# Altium schematic sheet 8 Clock buffer.SchDoc
size 420 x 297 mm; SheetNumber: 9; SheetTotal: 9
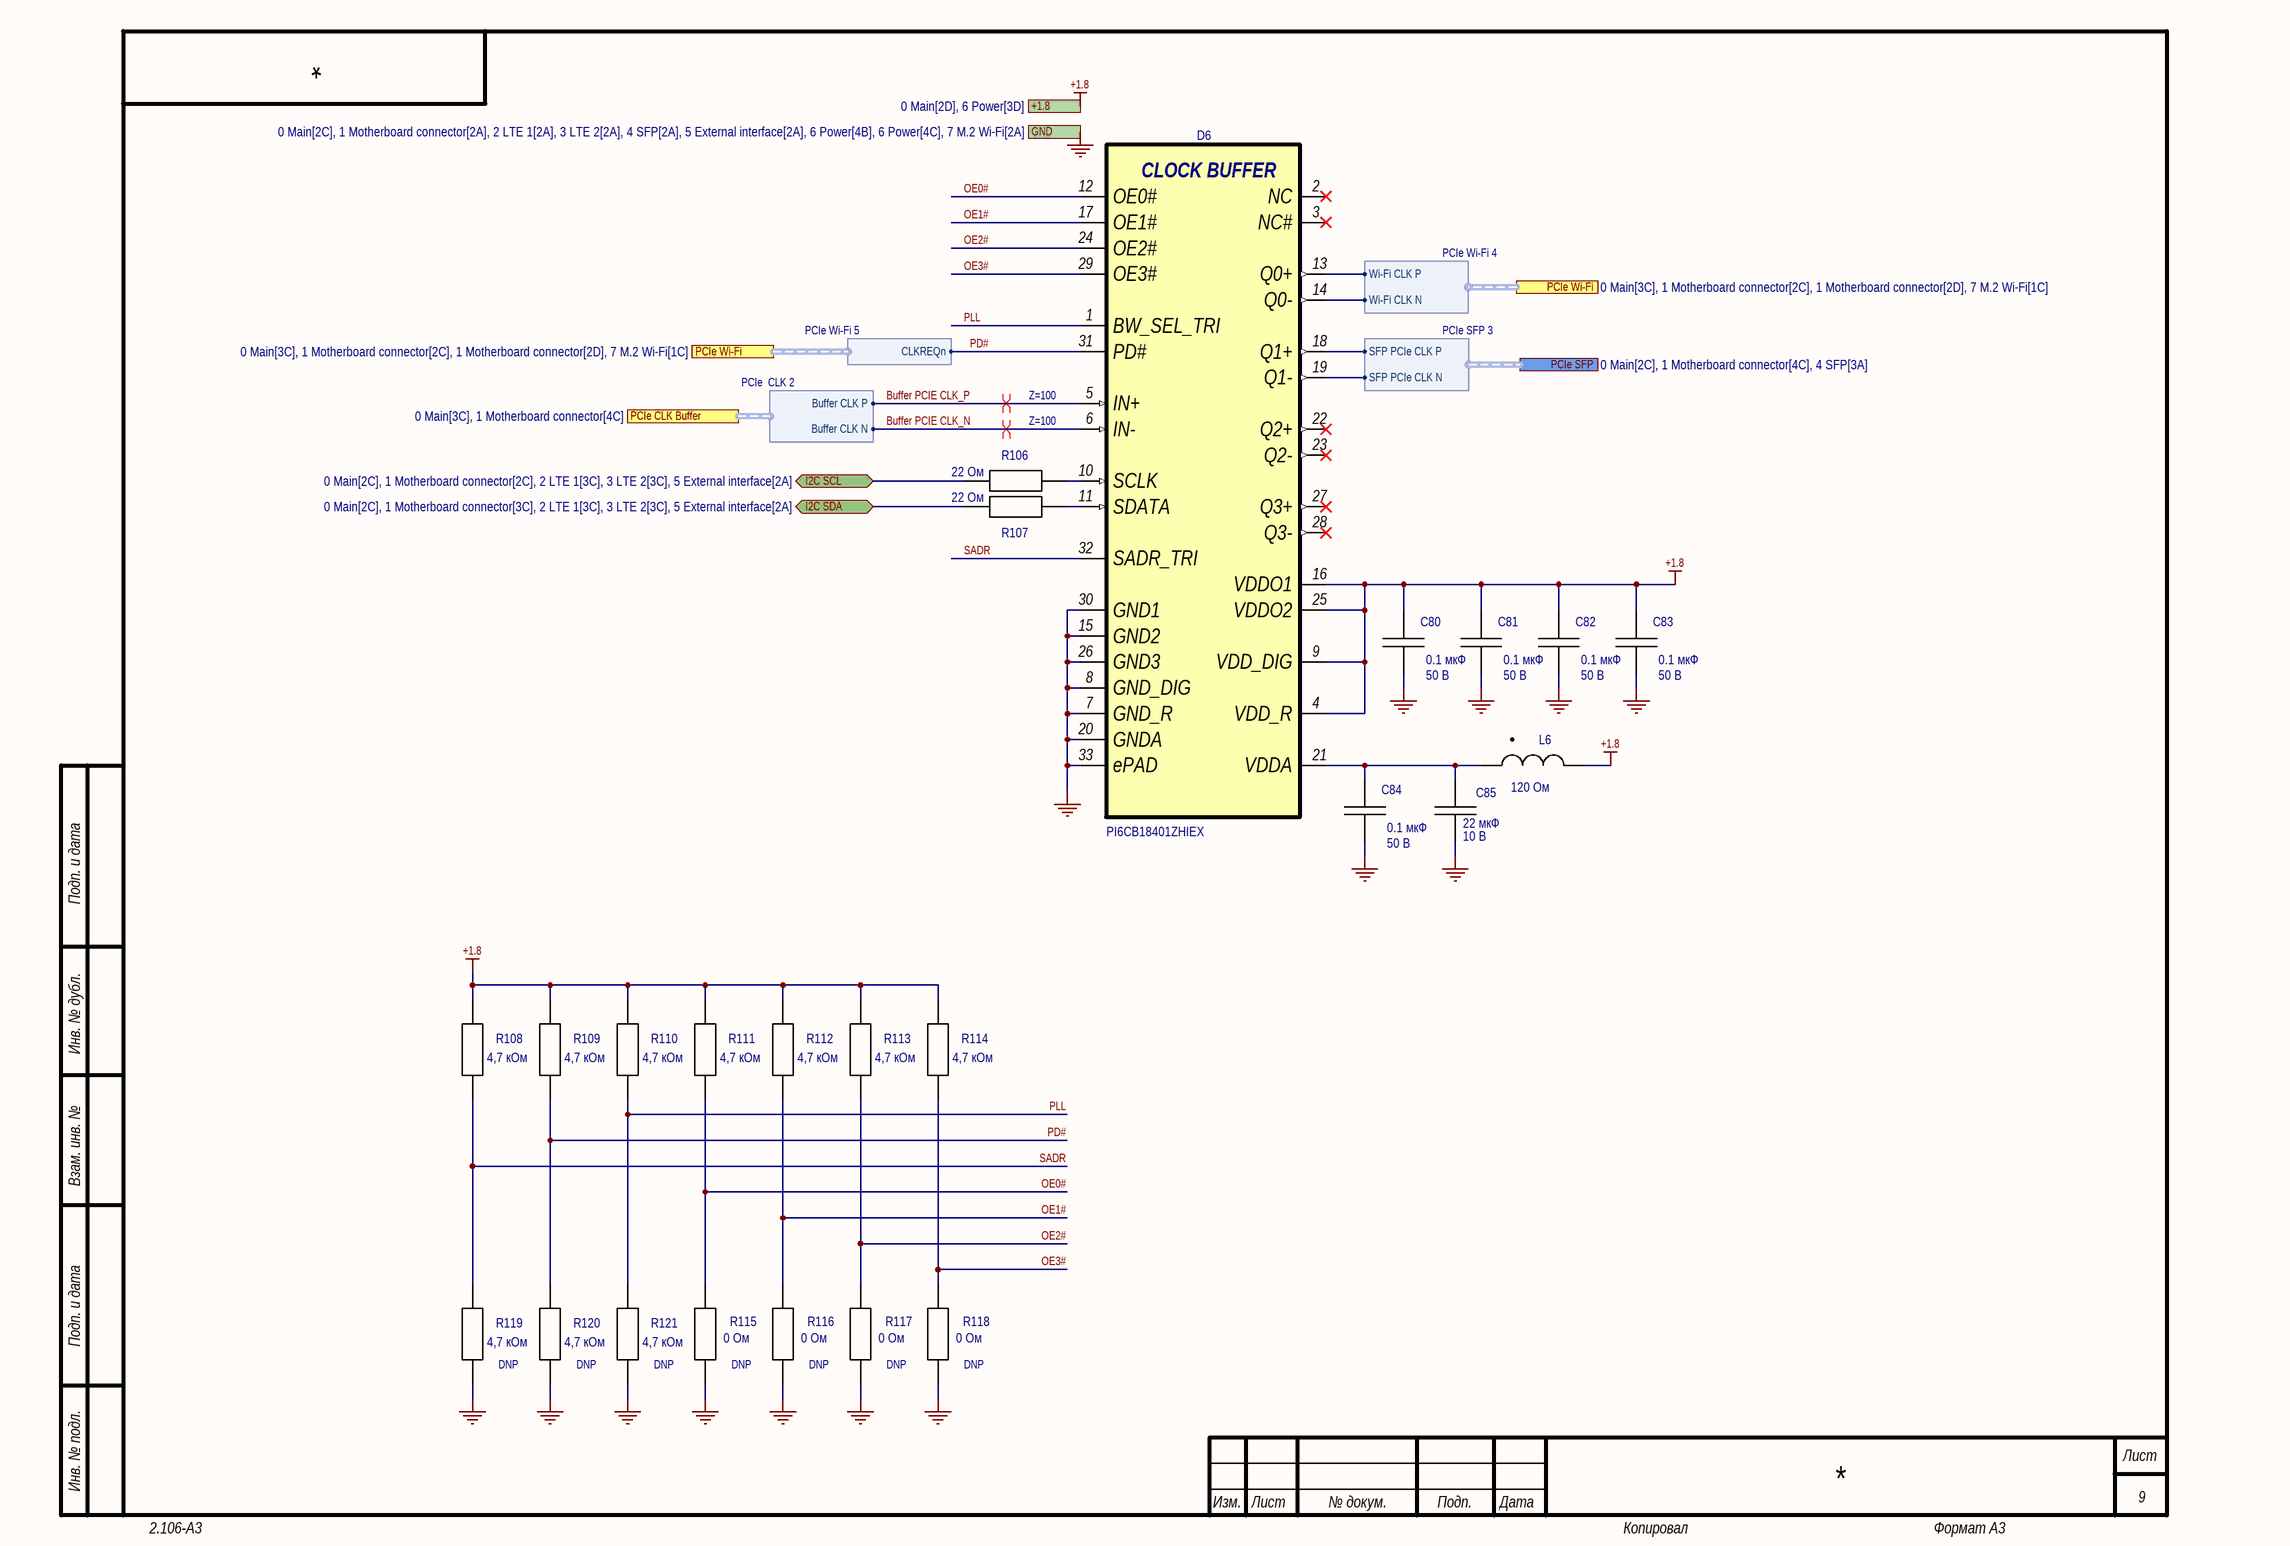
[diagram p0: 8 Clock buffer.SchDoc]

## Parts
C80  value 0.1 мкФ  Напряжение: 50 В  [CAP_0402]
C81  value 0.1 мкФ  Напряжение: 50 В  [CAP_0402]
C82  value 0.1 мкФ  Напряжение: 50 В  [CAP_0402]
C83  value 0.1 мкФ  Напряжение: 50 В  [CAP_0402]
C84  value 0.1 мкФ  Напряжение: 50 В  [CAP_0402]
C85  value 22 мкФ  Напряжение: 10 В  [CAP_0603]
D6  PI6CB18401ZHIEX  [TQFN-32]
L6  value 120 Ом  [IND_0402]  (hidden comment: STD_IND)
R106  value 22 Ом  [RES_0402]  (hidden comment: STD_RES)
R107  value 22 Ом  [RES_0402]  (hidden comment: STD_RES)
R108  value 4,7 кОм  [RES_0402]  (hidden comment: STD_RES)
R109  value 4,7 кОм  [RES_0402]  (hidden comment: STD_RES)
R110  value 4,7 кОм  [RES_0402]  (hidden comment: STD_RES)
R111  value 4,7 кОм  [RES_0402]  (hidden comment: STD_RES)
R112  value 4,7 кОм  [RES_0402]  (hidden comment: STD_RES)
R113  value 4,7 кОм  [RES_0402]  (hidden comment: STD_RES)
R114  value 4,7 кОм  [RES_0402]  (hidden comment: STD_RES)
R115  value 0 Ом  [RES_0402]  (hidden comment: STD_RES)
R116  value 0 Ом  [RES_0402]  (hidden comment: STD_RES)
R117  value 0 Ом  [RES_0402]  (hidden comment: STD_RES)
R118  value 0 Ом  [RES_0402]  (hidden comment: STD_RES)
R119  value 4,7 кОм  [RES_0402]  (hidden comment: STD_RES)
R120  value 4,7 кОм  [RES_0402]  (hidden comment: STD_RES)
R121  value 4,7 кОм  [RES_0402]  (hidden comment: STD_RES)

## Ports
+1.8 (see 0 Main[2D], 6 Power[3D]), GND (see 0 Main[2C], 1 Motherboard connector[2A], 2 LTE 1[2A], 3 LTE 2[2A], 4 SFP[2A], 5 External interface[2A], 6 Power[4B], 6 Power[4C], 7 M.2 Wi-Fi[2A]), I2C SCL (bidir, see 0 Main[2C], 1 Motherboard connector[2C], 2 LTE 1[3C], 3 LTE 2[3C], 5 External interface[2A]), I2C SDA (bidir, see 0 Main[2C], 1 Motherboard connector[3C], 2 LTE 1[3C], 3 LTE 2[3C], 5 External interface[2A]), PCIe CLK Buffer (harness PCIe  CLK 2, see 0 Main[3C], 1 Motherboard connector[4C]), PCIe SFP (harness PCIe SFP 3, see 0 Main[2C], 1 Motherboard connector[4C], 4 SFP[3A]), PCIe Wi-Fi (harness PCIe Wi-Fi 4, see 0 Main[3C], 1 Motherboard connector[2C], 1 Motherboard connector[2D], 7 M.2 Wi-Fi[1C]), PCIe Wi-Fi (harness PCIe Wi-Fi 5, see 0 Main[3C], 1 Motherboard connector[2C], 1 Motherboard connector[2D], 7 M.2 Wi-Fi[1C])

## Harnesses
PCIe Wi-Fi 4: Wi-Fi CLK P, Wi-Fi CLK N
PCIe SFP 3: SFP PCIe CLK P, SFP PCIe CLK N
PCIe Wi-Fi 5: CLKREQn
PCIe  CLK 2: Buffer CLK P, Buffer CLK N

## Nets
+1.8: C80.1 C81.1 C82.1 C83.1 D6.4(VDD_R) D6.9(VDD_DIG) D6.16(VDDO1) D6.25(VDDO2) L6.2 R108.2 R109.2 R110.2 R111.2 R112.2 R113.2 R114.2 ; port +1.8
GND: C80.2 C81.2 C82.2 C83.2 C84.2 C85.2 D6.7(GND_R) D6.8(GND_DIG) D6.15(GND2) D6.20(GNDA) D6.26(GND3) D6.30(GND1) D6.33(ePAD) R115.1 R116.1 R117.1 R118.1 R119.1 R120.1 R121.1 ; port GND
Buffer PCIE CLK_N: D6.6(IN-) ; port PCIe CLK Buffer.Buffer CLK N
Buffer PCIE CLK_P: D6.5(IN+) ; port PCIe CLK Buffer.Buffer CLK P
I2C SCL: R106.2 ; port I2C SCL
I2C SDA: R107.2 ; port I2C SDA
OE0#: D6.12(OE0#) R111.1 R115.2
OE1#: D6.17(OE1#) R112.1 R116.2
OE2#: D6.24(OE2#) R113.1 R117.2
OE3#: D6.29(OE3#) R114.1 R118.2
PD#: D6.31(PD#) R109.1 R120.2 ; port PCIe Wi-Fi.CLKREQn
PLL: D6.1(BW_SEL_TRI) R110.1 R121.2
SADR: D6.32(SADR_TRI) R108.1 R119.2
NetC84_1: C84.1 C85.1 D6.21(VDDA) L6.1
NetD6_10: D6.10(SCLK) R106.1
NetD6_11: D6.11(SDATA) R107.1
NetD6_13: D6.13(Q0+) ; port PCIe Wi-Fi.Wi-Fi CLK P
NetD6_14: D6.14(Q0-) ; port PCIe Wi-Fi.Wi-Fi CLK N
NetD6_18: D6.18(Q1+) ; port PCIe SFP.SFP PCIe CLK P
NetD6_19: D6.19(Q1-) ; port PCIe SFP.SFP PCIe CLK N

Not connected (* = marked no-connect by the designer): D6 2(NC)* 3(NC#)* 22(Q2+)* 23(Q2-)* 27(Q3+)* 28(Q3-)*

## Layout directives
differential pair; differential pair class Z=100: Buffer PCIE CLK_N, Buffer PCIE CLK_P

## Notes on the sheet
- DNP
- (near R118) DNP
- Подп. и дата
- Инв. № дубл.
- Взам. инв. №
- Инв. № подл.
- Изм.
- Лист
- № докум.
- Подп.
- Дата
- 2.106-A3
- Копировал
- Формат А3
- (in symbol PI6CB18401ZHIEX) CLOCK BUFFER

## Library data of the parts
C80-C84 = CC0402KRX7R9BB104: Конденсатор CHIP-0402 0.1 мкФ 50 В 10% X7R; Manufacturer: YAGEO; ID: 357; Температура: -55...+85°C; Autor: Admin; PartNumber: CC0402KRX7R9BB104; Type: CHIP-0402; Tolerance: 10%; Диэлектрик: X7R; Data: 10-04-2024
C85 = GRM188R61A226ME15: Конденсатор CHIP-0603 22 мкФ 10 В 20% X5R; Manufacturer: MURATA; ID: 233; Температура: -55...+85°C; Autor: Admin; PartNumber: GRM188R61A226ME15; Type: CHIP-0603; Tolerance: 20%; Диэлектрик: X5R; Data: 01-05-2018
D6 = PI6CB18401ZHIEX: Микросхема Diodes  HCSL Fanout Buffer; ID: 820; Type: Interfaces; Voltage: 3,3В; Current: 40 мА; Температура: -40...+85°C; Autor: Admin; PartNumber: PI6CB18401ZHIEX; Value: HCSL Fanout Buffer; Manufacturer: Diodes; Data: 12-05-2024
L6 = BLM15AG121SN1D: Катушка индуктивности BEAD-0402 120 Ом 25%; Manufacturer: MURATA; ID: 234; Current: 550 мА; Температура: -40...+85°C; Autor: Admin; PartNumber: BLM15AG121SN1D; Type: BEAD-0402; Tolerance: 25%; Data: 10-18-2024
R106 R107 = RC0402FR-0722RL: Резистор CHIP-0402 22 Ом 1%; Manufacturer: YAGEO; ID: 272; ТКС: 100 ppm/K; Температура: -55...+155°C; Autor: Цислав А.Н.; PartNumber: RC0402FR-0722RL; Type: CHIP-0402; Tolerance: 1%; Data: 02-03-2014
R108-R114 R119-R121 = RC0402FR-074K7L: Резистор CHIP-0402 4,7 кОм 1%; Manufacturer: YAGEO; ID: 381; ТКС: 100 ppm/K; Температура: -55...+155°C; Autor: Цислав А.Н.; PartNumber: RC0402FR-074K7L; Type: CHIP-0402; Tolerance: 1%; Data: 02-03-2014
R115-R118 = RC0402JR-070RL: Резистор CHIP-0402 0 Ом 5%; Manufacturer: YAGEO; ID: 236; ТКС: 100 ppm/K; Температура: -55...+85°C; Autor: Admin; PartNumber: RC0402JR-070RL; Type: CHIP-0402; Tolerance: 5%; Data: 04-22-2025